# EasyEDA Pro project Source_Doom_Bcard.epro

# Schematic Schematic1
Board Name: Board1; Create Date: 2026-06-03; Page Name: P1; Project Name: DOOM Busniess Card; Schematic Name: Schematic1; Update Date: 2026-06-08; Company: EasyEDA.com; Page Size: A4; Version: V1.0
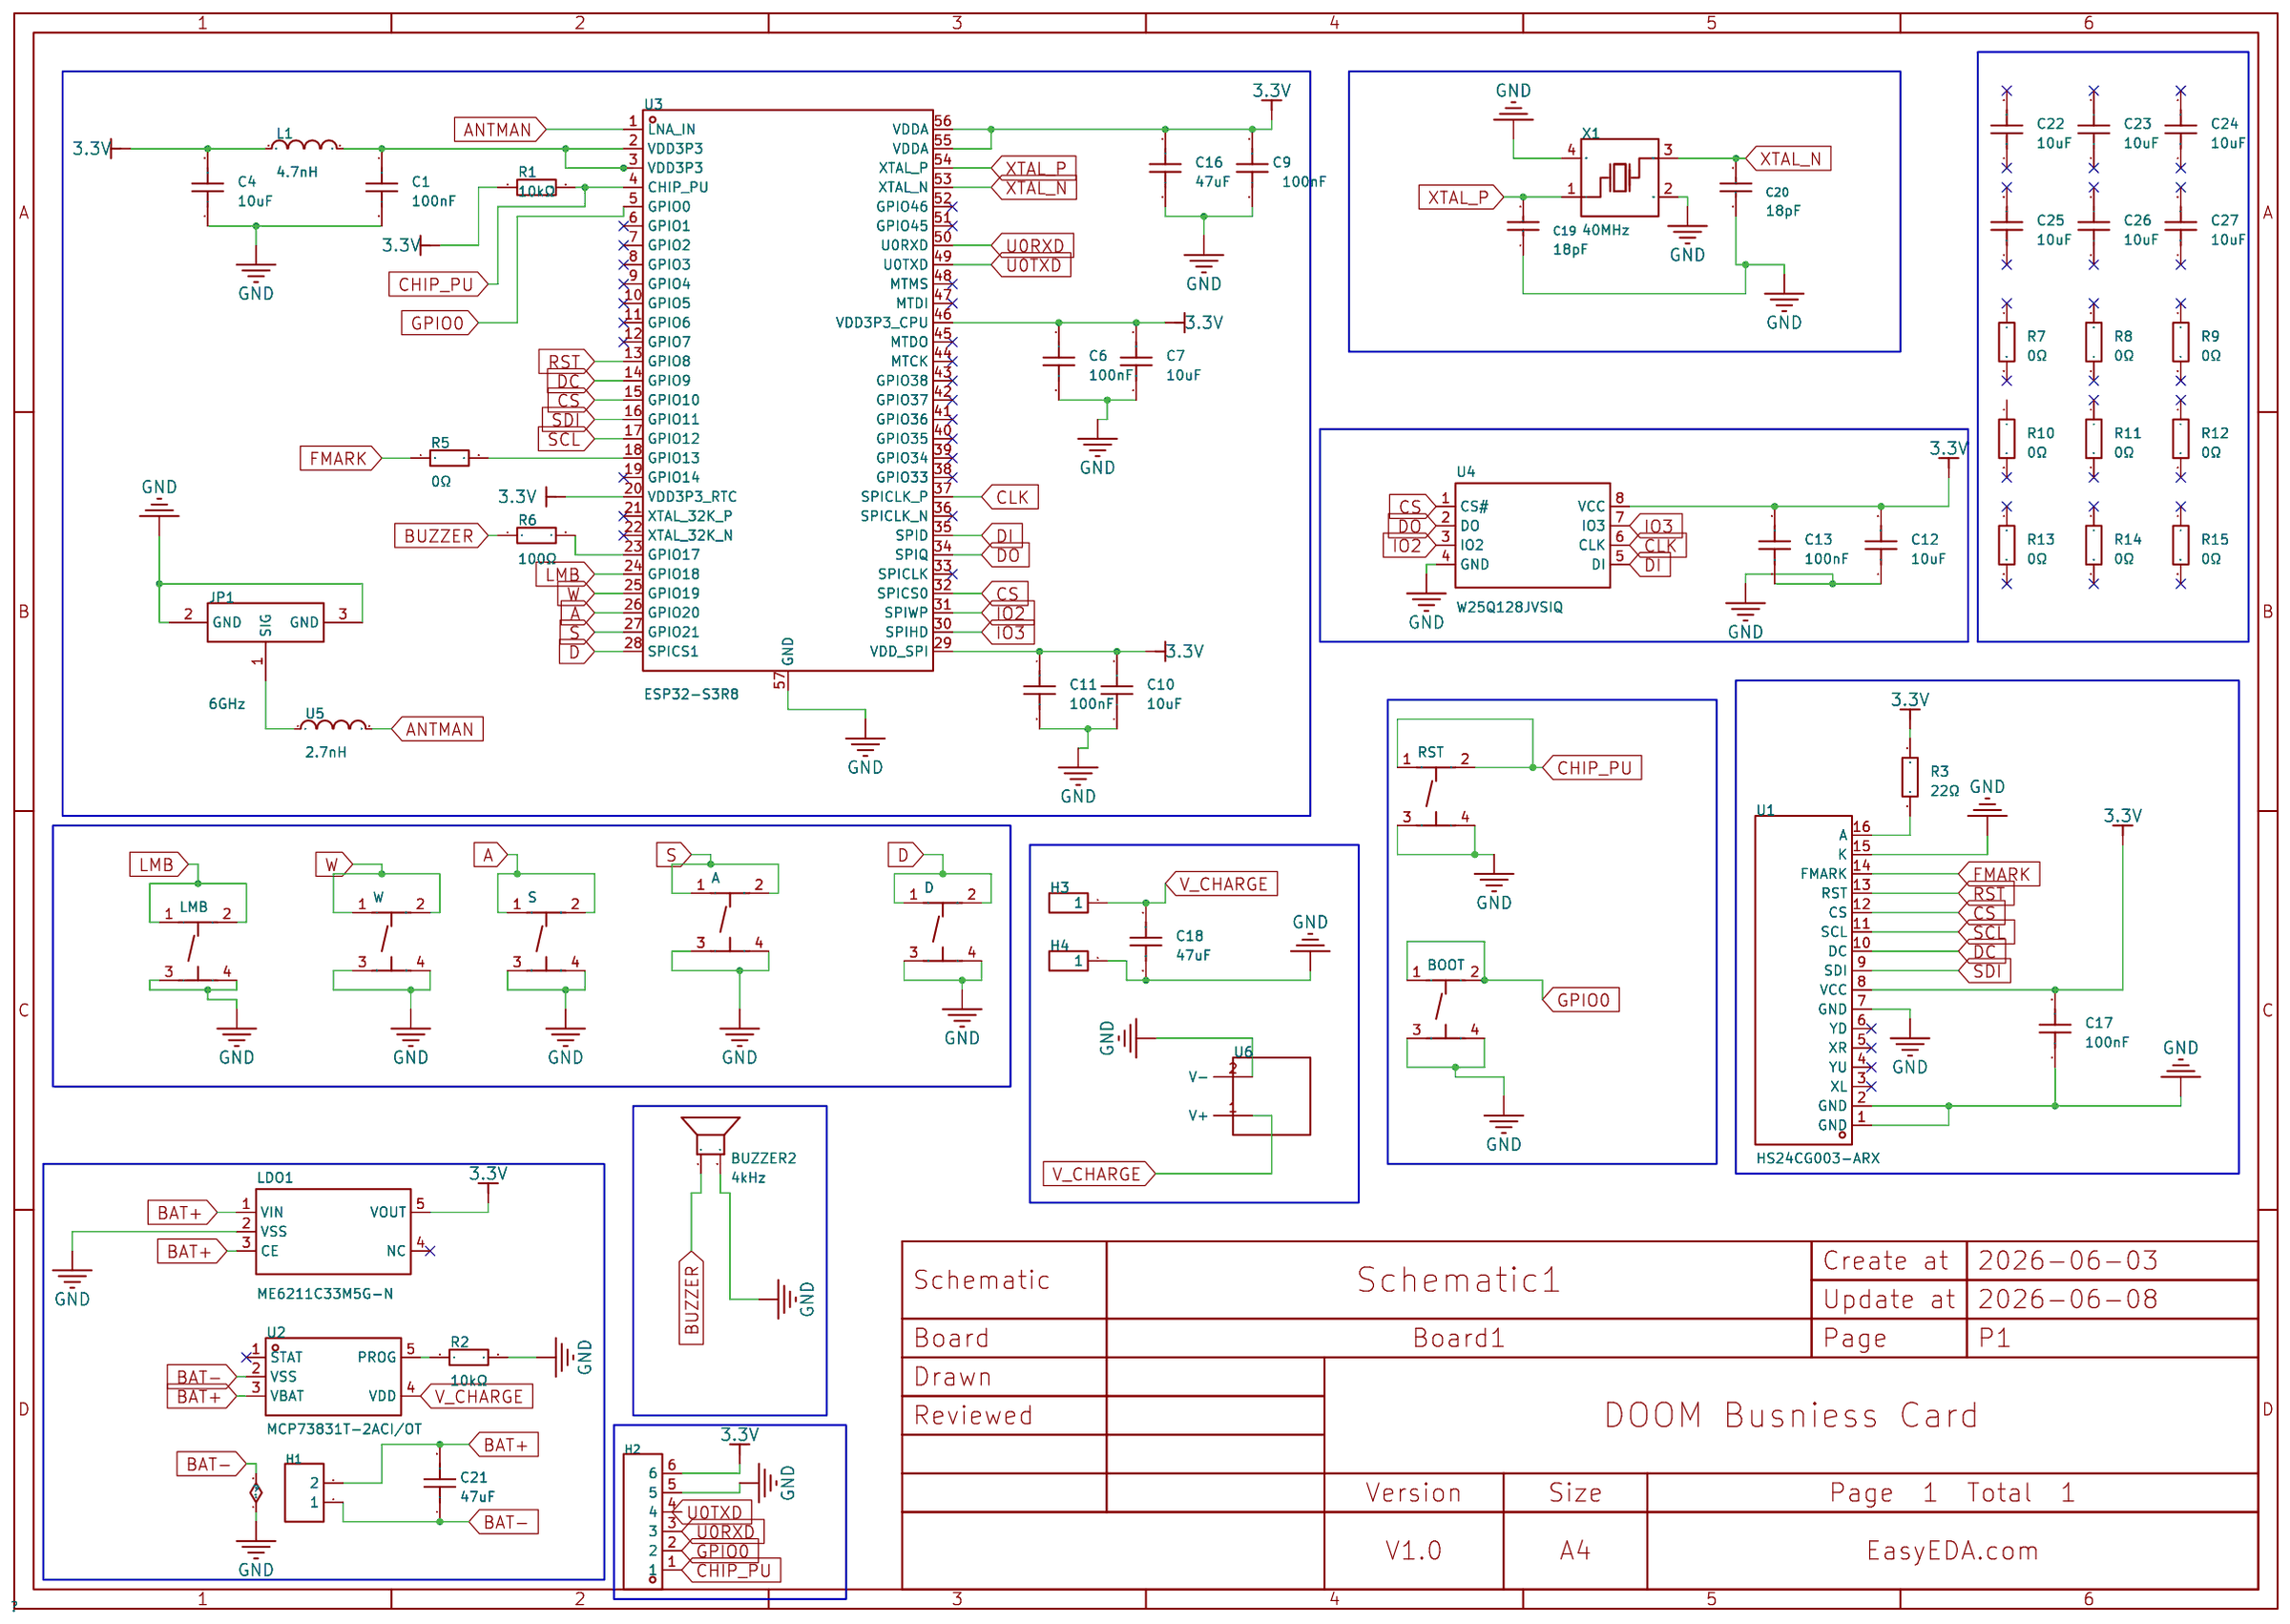
[diagram p0: schematic sheet]

## Parts
A  TS-1187A-B-A-B  [SW-SMD_4P-L5.1-W5.1-P3.70-LS6.5-TL_H1.5]
BOOT  TS-1187A-B-A-B  [SW-SMD_4P-L5.1-W5.1-P3.70-LS6.5-TL_H1.5]
BUZZER2  4kHz  [BUZ-SMD_L10.0-W10.0_GSC1030RB-3V4000]
C1  100nF  [C0402]
C4  10uF  [C0402]
C6  100nF  [C0402]
C7  10uF  [C0402]
C9  100nF  [C0402]
C10  10uF  [C0402]
C11  100nF  [C0402]
C12  10uF  [C0402]
C13  100nF  [C0402]
C16  47uF  [C0603]
C17  100nF  [C0402]
C18  47uF  [C0603]
C19  18pF  [C0402]
C20  18pF  [C0402]
C21  47uF  [C0603]
C22  10uF  [C0402]
C23  10uF  [C0402]
C24  10uF  [C0402]
C25  10uF  [C0402]
C26  10uF  [C0402]
C27  10uF  [C0402]
D  TS-1187A-B-A-B  [SW-SMD_4P-L5.1-W5.1-P3.70-LS6.5-TL_H1.5]
H1  -  [HDR-TH_2P-P2.54-V-F]
H2  -  [HDR-TH_6P-P2.54-V-F]
H3  -  [HDR-TH_1P-V-M_XKB_X4611WV-01I-C28D40]
H4  -  [HDR-TH_1P-V-M_XKB_X4611WV-01I-C28D40]
JP1  6GHz  [RF-SMD_FRF05002-JSS103M]
L1  4.7nH  [L0402-RD]
LDO1  ME6211C33M5G-N  [SOT-23-5_L3.0-W1.7-P0.95-LS2.8-BL]
LMB  TS-1187A-B-A-B  [SW-SMD_4P-L5.1-W5.1-P3.70-LS6.5-TL_H1.5]
R1  10kΩ  [R0402]
R2  10kΩ  [R0402]
R3  22Ω  [R0402]
R5  0Ω  [R0402]
R6  100Ω  [R0402]
R7  0Ω  [R0402]
R8  0Ω  [R0402]
R9  0Ω  [R0402]
R10  0Ω  [R0402]
R11  0Ω  [R0402]
R12  0Ω  [R0402]
R13  0Ω  [R0402]
R14  0Ω  [R0402]
R15  0Ω  [R0402]
RST  TS-1187A-B-A-B  [SW-SMD_4P-L5.1-W5.1-P3.70-LS6.5-TL_H1.5]
S  TS-1187A-B-A-B  [SW-SMD_4P-L5.1-W5.1-P3.70-LS6.5-TL_H1.5]
U1  HS24CG003-ARX  [LCD-SMD_HS24CG003-ARX]
U2  MCP73831T-2ACI/OT  [SOT-23-5_L3.0-W1.7-P0.95-LS2.8-BL]
U3  ESP32-S3R8  [QFN-56_L7.0-W7.0-P0.40-TL-EP4.0]
U4  W25Q128JVSIQ  [SOIC-8_L5.3-W5.3-P1.27-LS8.0-BL]
U5  2.7nH  [L0402]
U6  -  [Voltatic 0.3 Watt 6 Volt Solar panel]
W  TS-1187A-B-A-B  [SW-SMD_4P-L5.1-W5.1-P3.70-LS6.5-TL_H1.5]
X1  40MHz  [OSC-SMD_4P-L3.2-W2.5-BL_SIT8008BI]

## Library data of the parts
A BOOT D LMB RST S W = TS-1187A-B-A-B: Circuit:SPST Actuator Style:Round Button Operating Force:1.6N Mounting Type:Surface Mount,Vertical Length:5.1mm Width:5.1mm Switch Height:1.5mm with Bracket:Without Bracket Contact Current:50mA Voltage Rating:12V Actuator/Cap Color:Gold With Lamp:No Life:; LCSC Part Name: 5.1*5.1*1.5mm 立贴 轻触开关; Supplier Part: C318884; Manufacturer: XKB Connection(中国星坤); Supplier Footprint: SMD; JLCPCB Part Class: Basic Part; Datasheet: https://item.szlcsc.com/datasheet/TS-1187A-B-A-B/299976.html; Supplier: LCSC; Circuit: SPST; Actuator Style: Round Button; Operating Force: 1.6N; Mounting Type: Surface Mount,Vertical; Length: 5.1mm; Width: 5.1mm; Switch Height: 1.5mm; with Bracket: Without Bracket; Contact Current: 50mA; Voltage Rating: 12V; Actuator/Cap Color: Gold; With Lamp: No; Life: 100,000 Cycles; Operating Temperature: -30℃~+85℃
BUZZER2 = GSC1030RB-3V4000: Driver Circuitry:Passive (Externally Driven) Technology:Piezoelectric Voltage Rating:3V Voltage - Supply:1V~25V Voltage - Supply:1V~25V Frequency:4kHz Current Consumption:5mA Sound Pressure Level(SPL):72dB Length:10mm Width:10mm Height:3.3mm Operating Tem; LCSC Part Name: 压电无源蜂鸣器; Supplier Part: C255330; Manufacturer: INGHAi(赢海); JLCPCB Part Class: Extended Part; Datasheet: https://item.szlcsc.com/datasheet/GSC1030RB-3V4000/249282.html; Supplier: LCSC; Driver Circuitry: Passive (Externally Driven); Technology: Piezoelectric; Voltage Rating: 3V; Voltage - Supply: 1V~25V; Current Consumption: 5mA; Sound Pressure Level(SPL): 72dB; Length: 10mm; Width: 10mm; Height: 3.3mm; Operating Temperature: -20℃~+60℃
C1 C6 C9 C11 C13 C17 = CC0402KRX7R9BB104: Capacitance: Tolerance:±10% Tolerance:±10% Voltage Rated: Temperature Coefficient:; LCSC Part Name: 100nF ±10% 50V; Supplier Part: C131394; Manufacturer: YAGEO(国巨); Supplier Footprint: 0402; JLCPCB Part Class: Extended Part; Datasheet: https://atta.szlcsc.com/upload/public/pdf/source/20181008/C309510_22F155564471FAF6A489F7D68F34234E.pdf; Supplier: LCSC; Tolerance: ±10%
C4 C7 C10 C12 C22-C27 = CL05A106MP5NUNC_C315248: Capacitance:10uF Tolerance:±20% Tolerance:±20% Voltage Rating:10V Temperature Coefficient:X5R; LCSC Part Name: 10uF ±20% 10V; Supplier Part: C315248; Manufacturer: SAMSUNG(三星); Manufacturer Part: CL05A106MP5NUNC; Supplier Footprint: 0402; JLCPCB Part Class: Extended Part; Datasheet: https://item.szlcsc.com/datasheet/CL05A106MP5NUNC/297154.html; Supplier: LCSC; Tolerance: ±20%; Voltage Rating: 10V; Temperature Coefficient: X5R
C16 C18 C21 = CL10A476MQ8QRNC: LCSC Part Name: 47uF ±20% 6.3V; Supplier Part: C730416; Manufacturer: SAMSUNG(三星); Supplier Footprint: 0603; JLCPCB Part Class: Extended Part; Datasheet: https://atta.szlcsc.com/upload/public/pdf/source/20160218/1457707763339.pdf; Supplier: LCSC; Tolerance: ±20%
C19 C20 = CC0402JRNPO9BN180: Capacitance:18pF Tolerance:±5% Tolerance:±5% Voltage Rating:50V Temperature Coefficient:NP0; LCSC Part Name: 18pF ±5% 50V; Supplier Part: C106202; Manufacturer: YAGEO(国巨); Supplier Footprint: 0402; JLCPCB Part Class: Extended Part; Datasheet: https://item.szlcsc.com/datasheet/CC0402JRNPO9BN180/107417.html; Supplier: LCSC; Tolerance: ±5%; Voltage Rating: 50V; Temperature Coefficient: NP0
H1 = HDR-F_2.54_1x2P: Supplier Footprint: Through
H2 = HDR-F_2.54_1x6P: Supplier Footprint: Through
H3 H4 = HDR-M_2.54_1x1P: Supplier Footprint: Through; Check: false
JP1 = U.FL-R-SMT-1(80)_C88374: Connector Type:Board Side Interface:Male Pin Number of Ports:1 Interface Diameter:2mm Interface Length/Height:1.25mm Frequency:6GHz RF Series:IPEX Impedance:50Ω Style:- Operating Temperature Range:-40℃~+90℃ Operating Temperature Range:-40℃~+90℃; LCSC Part Name: IPEX 内针; Supplier Part: C88374; Manufacturer: HRS(广濑); Manufacturer Part: U.FL-R-SMT-1(80); Supplier Footprint: SMD; JLCPCB Part Class: Extended Part; Datasheet: https://item.szlcsc.com/datasheet/U.FL-R-SMT-1(80)/89553.html; Supplier: LCSC; Connector Type: Board Side; Interface: Male Pin; Number of Ports: 1; Interface Diameter: 2mm; Interface Length/Height: 1.25mm; RF Series: IPEX; Impedance: 50Ω; Operating Temperature Range: -40℃~+90℃
L1 = MLG1005S4N7CT000: Inductance: Tolerance:- Tolerance:- Current Rating: Current - Saturation (Isat):- DC Resistance(DCR): Q @ Frequency:8@100MHz Frequency - Self Resonant: Ratings:; LCSC Part Name: ±0.2nH 4.7nH; Supplier Part: C275292; Manufacturer: TDK; Supplier Footprint: 0402; JLCPCB Part Class: Extended Part; Datasheet: https://atta.szlcsc.com/upload/public/pdf/source/20240116/5498F69597B6145D9954BDAE22913204.pdf; Supplier: LCSC; Q @ Frequency: 8@100MHz
LDO1 = ME6211C33M5G-N: Output Type:Fixed Voltage - Supply:6V Output Voltage:3.3V Output Voltage:3.3V Output Current:500mA Power Supply Rejection Ratio (PSRR):70dB@(1kHz) Voltage Dropout:120mV@(100mA) standby current:60uA Noise:50uVrms Features:Over Current Protection；Enable；Sho; LCSC Part Name: 输入6V 输出3.3V 500mA; Supplier Part: C82942; Manufacturer: MICRONE(南京微盟); Supplier Footprint: SOT-23-5; JLCPCB Part Class: Extended Part; Datasheet: https://item.szlcsc.com/datasheet/ME6211C33M5G-N/84106.html; Supplier: LCSC; Output Type: Fixed; Voltage - Supply: 6V; Output Voltage: 3.3V; Output Current: 500mA; Power Supply Rejection Ratio (PSRR): 70dB@(1kHz); Voltage Dropout: 120mV@(100mA); standby current: 60uA; Noise: 50uVrms; Features: Over Current Protection；Enable；Short Circuit Protection; Operating Temperature: -40℃~+150℃; Output Configuration: Positive; Number of Outputs: 1
R1 R2 = RT0402BRD0710KL: Type:Thin Film Resistor Resistance:10kΩ Tolerance:±0.1% Tolerance:±0.1% Power(Watts):62.5mW Voltage-Supply(Max):50V Temperature Coefficient:±25ppm/℃ Temperature Coefficient:±25ppm/℃ Operating Temperature:-55℃~+155℃ Operating Temperature:-55℃~+155℃; LCSC Part Name: 薄膜电阻 10kΩ ±0.1% 62.5mW; Supplier Part: C190095; Manufacturer: YAGEO(国巨); Supplier Footprint: 0402; JLCPCB Part Class: Extended Part; Datasheet: https://item.szlcsc.com/datasheet/RT0402BRD0710KL/208478.html; Supplier: LCSC; Type: Thin Film Resistor; Tolerance: ±0.1%; Power(Watts): 62.5mW; Voltage-Supply(Max): 50V; Temperature Coefficient: ±25ppm/℃; Operating Temperature: -55℃~+155℃
R3 = RC0402FR-0722RL: Type:Thick Film Resistors Resistance: Tolerance:±1% Tolerance:±1% Power(Watts): Overload Voltage (Max): Temperature Coefficient:±100ppm/℃ Temperature Coefficient:±100ppm/℃ Operating Temperature Range:-55℃~+155℃ Operating Temperature Range:-55℃~+155℃; LCSC Part Name: 厚膜电阻 22Ω ±1% 62.5mW; Supplier Part: C114765; Manufacturer: YAGEO(国巨); Supplier Footprint: 0402; JLCPCB Part Class: Extended Part; Datasheet: https://atta.szlcsc.com/upload/public/pdf/source/20180821/C275644_0D56F95EFF785E7D9A1FEF436B37DA78.pdf; Supplier: LCSC; Type: Thick Film Resistors; Tolerance: ±1%; Temperature Coefficient: ±100ppm/℃; Operating Temperature Range: -55℃~+155℃
R5 R7-R15 = RC0402FR-070RL: Type:Thick Film Resistors Resistance:0Ω Tolerance:±1% Tolerance:±1% Power(Watts):62.5mW Voltage-Supply(Max):50V Temperature Coefficient:- Temperature Coefficient:- Operating Temperature:-55℃~+155℃ Operating Temperature:-55℃~+155℃; LCSC Part Name: 厚膜电阻 0Ω ±1% 62.5mW; Supplier Part: C106231; Manufacturer: YAGEO(国巨); Supplier Footprint: 0402; JLCPCB Part Class: Extended Part; Datasheet: https://item.szlcsc.com/datasheet/RC0402FR-070RL/107446.html; Supplier: LCSC; Type: Thick Film Resistors; Tolerance: ±1%; Power(Watts): 62.5mW; Voltage-Supply(Max): 50V; Operating Temperature: -55℃~+155℃
R6 = RC0402FR-07100RL: Type:Thick Film Resistor Resistance:100Ω Tolerance:±1% Tolerance:±1% Power(Watts):62.5mW Voltage-Supply(Max):50V Temperature Coefficient:±100ppm/℃ Temperature Coefficient:±100ppm/℃ Operating Temperature:-55℃~+155℃ Operating Temperature:-55℃~+155℃; LCSC Part Name: 厚膜电阻 100Ω ±1% 62.5mW; Supplier Part: C106232; Manufacturer: YAGEO(国巨); Supplier Footprint: 0402; JLCPCB Part Class: Extended Part; Datasheet: https://item.szlcsc.com/datasheet/RC0402FR-07100RL/107447.html; Supplier: LCSC; Type: Thick Film Resistor; Tolerance: ±1%; Power(Watts): 62.5mW; Voltage-Supply(Max): 50V; Temperature Coefficient: ±100ppm/℃; Operating Temperature: -55℃~+155℃
U1 = HS24CG003-ARX: Controller Type:ST7789 Interface:SPI Size:2.4 Dot Pixels:320x240 Operating Temperature:-20℃~+70℃ Operating Temperature:-20℃~+70℃ Display Range:36.72x48.96mm Voltage - Supply:2.4V~3.3V；1.65V~3.3V Voltage - Supply:2.4V~3.3V；1.65V~3.3V; LCSC Part Name: 2.4寸240*320(RGB)彩色SPI串口TFT液晶显示屏; Supplier Part: C5329583; Manufacturer: HS(汉昇); JLCPCB Part Class: Extended Part; Datasheet: https://item.szlcsc.com/datasheet/HS24CG003-ARX/6087844.html; Supplier: LCSC; Controller Type: ST7789; Interface: SPI; Size: 2.4; Dot Pixels: 320x240; Operating Temperature: -20℃~+70℃; Display Range: 36.72x48.96mm; Voltage - Supply: 2.4V~3.3V；1.65V~3.3V
U2 = MCP73831T-2ACI/OT: The Chip Type:Charging IC Voltage - Supply:3.75V~6V Voltage - Supply:3.75V~6V Charge Current - Max:550mA Charging Saturation Voltage:4.2V End-Off Voltage:- Type of Battery:Lithium Battery Number of Cells:1 Number of Cells:1 Operating Temperature:-40℃~+85℃; LCSC Part Name: 单节锂离子/锂聚合物充电管理控制器; Supplier Part: C424093; Manufacturer: MICROCHIP(美国微芯); Supplier Footprint: SOT-23-5; JLCPCB Part Class: Extended Part; Datasheet: https://item.szlcsc.com/datasheet/MCP73831T-2ACI%252FOT/417116.html; Supplier: LCSC; The Chip Type: Charging IC; Voltage - Supply: 3.75V~6V; Charge Current - Max: 550mA; Charging Saturation Voltage: 4.2V; Type of Battery: Lithium Battery; Number of Cells: 1; Operating Temperature: -40℃~+85℃; Battery Temperature Detection: Not supported; Supply Current (Iq): 53uA
U3 = ESP32-S3R8: Frequency Range:2.412GHz~2.484GHz Frequency Range:2.412GHz~2.484GHz Interface:I2C；I2S；UART；USB；SPI Voltage - Supply:3V~3.6V Voltage - Supply:3V~3.6V Applications:Bluetooth；WiFi Output Power:18.5dBm Data Rate:150Mbps Current Of Transmitting:283mA Sensitivi; LCSC Part Name: 不带固件 2.4GHz Wi-Fi + 低功耗蓝牙系统级芯片（SoC）; Supplier Part: C2913194; Manufacturer: ESPRESSIF(乐鑫); Supplier Footprint: QFN-56(7x7); JLCPCB Part Class: Extended Part; Datasheet: https://item.szlcsc.com/datasheet/ESP32-S3R8/3198292.html; Supplier: LCSC; Frequency Range: 2.412GHz~2.484GHz; Interface: I2C；I2S；UART；USB；SPI; Voltage - Supply: 3V~3.6V; Applications: Bluetooth；WiFi; Output Power: 18.5dBm; Data Rate: 150Mbps; Current Of Transmitting: 283mA; Sensitivity: -74.2dBm; Receive Current: 88mA; Typical Application Frequency: 2.4GHz; Operating Temperature: -40℃~+65℃; Type: transceiver
U4 = W25Q128JVSIQ: Interface:SPI Memory Size:128Mbit Clock Frequency:133MHz Voltage - Supply:2.7V~3.6V Voltage - Supply:2.7V~3.6V Standby Supply Current:1uA Program / Erase Cycles:100,000 Cycles Page Programming Time (Tpp):3ms Block Erase Time(tBE):120ms@(32KB) Data Retenti; LCSC Part Name: 编带 支持双路/四路SPI接口的3V、128Mbit 串行闪存; Supplier Part: C97521; Manufacturer: Winbond(华邦); Supplier Footprint: SOIC-8-208mil; JLCPCB Part Class: Basic Part; Datasheet: https://item.szlcsc.com/datasheet/W25Q128JVSIQ/98729.html; Supplier: LCSC; Interface: SPI; Memory Size: 128Mbit; Clock Frequency: 133MHz; Voltage - Supply: 2.7V~3.6V; Standby Supply Current: 1uA; Program / Erase Cycles: 100,000 Cycles; Page Programming Time (Tpp): 3ms; Block Erase Time(tBE): 120ms@(32KB); Data Retention - TDR (Year): 20 Years; Operating Temperature: -40℃~+85℃
U5 = LQW15AN2N7B8ZD: Inductance:2.7nH Current Rating:1.5A DC Resistance(DCR):47mΩ Ratings:AEC-Q200; Supplier Part: C7295850; Manufacturer: muRata(村田); Supplier Footprint: 0402; JLCPCB Part Class: Extended Part; Datasheet: https://item.szlcsc.com/datasheet/LQW15AN2N7B8ZD/8265729.html; Supplier: LCSC; Current Rating: 1.5A; DC Resistance(DCR): 47mΩ; Ratings: AEC-Q200
U6 = Voltatic 0.3 Watt 6 Volt Panel: Solar Panel; Check: false
X1 = X322540MPB4SI: Type:Crystal Oscillator Frequency:40MHz Normal temperature Frequency Tolerance:±10ppm Normal temperature Frequency Tolerance:±10ppm Load Capacitance:15pF Frequency Stability:±20ppm Frequency Stability:±20ppm Operating Temperature:-40℃~+85℃ Operating Tempe; LCSC Part Name: YSX321SL 40MHZ 4P 3225 15PF ±10PPM -40~85℃ (±20PPM); Supplier Part: C9010; Manufacturer: YXC(扬兴晶振); Supplier Footprint: SMD3225-4P; JLCPCB Part Class: Extended Part; Datasheet: https://item.szlcsc.com/datasheet/X322540MPB4SI/9530.html; Supplier: LCSC; Type: Crystal Oscillator; Normal temperature Frequency Tolerance: ±10ppm; Load Capacitance: 15pF; Frequency Stability: ±20ppm; Operating Temperature: -40℃~+85℃

## Nets
3.3V: C4.2 C6.1 C7.2 C9.1 C10.2 C11.1 C12.2 C13.1 C16.1 C17.2 H2.6 L1.1 LDO1.5(VOUT) R1.1 R3.1 U1.8(VCC) U3.20(VDD3P3_RTC) U3.29(VDD_SPI) U3.46(VDD3P3_CPU) U3.55(VDDA) U3.56(VDDA) U4.8(VCC)
GND: A.3(C) A.4(D) BOOT.3(C) BOOT.4(D) BUZZER2.2 C1.2 C4.1 C6.2 C7.1 C9.2 C10.1 C11.2 C12.1 C13.2 C16.2 C17.1 C18.2 C19.1 C20.1 C21.1 D.3(C) D.4(D) H1.1 H2.5 H4.1 JP1.2(GND) JP1.3(GND) LDO1.2(VSS) LMB.3(C) LMB.4(D) R2.2 RST.3(C) RST.4(D) S.3(C) S.4(D) U1.1(GND) U1.2(GND) U1.7(GND) U1.15(K) U2.2(VSS) U3.57(GND) U4.4(GND) U6.2(V-) W.3(C) W.4(D) X1.2(GND) X1.4(GND)
A: S.1(A) S.2(B) U3.26(GPIO20)
ANTMAN: U3.1(LNA_IN) U5.2
BAT+: C21.2 H1.2 LDO1.1(VIN) LDO1.3(CE) U2.3(VBAT)
BUZZER: BUZZER2.1 R6.1
CHIP_PU: H2.1 R1.2 RST.1(A) RST.2(B) U3.4(CHIP_PU)
CLK: U3.37(SPICLK_P) U4.6(CLK)
CS: U1.12(CS) U3.15(GPIO10) U3.32(SPICS0) U4.1(CS#)
D: D.1(A) D.2(B) U3.28(SPICS1)
DC: U1.10(DC) U3.14(GPIO9)
DI: U3.35(SPID) U4.5(DI)
DO: U3.34(SPIQ) U4.2(DO)
FMARK: R5.1 U1.14(FMARK)
GPIO0: BOOT.1(A) BOOT.2(B) H2.2 U3.5(GPIO0)
IO2: U3.31(SPIWP) U4.3(IO2)
IO3: U3.30(SPIHD) U4.7(IO3)
LMB: LMB.1(A) LMB.2(B) U3.24(GPIO18)
RST: U1.13(RST) U3.13(GPIO8)
S: A.1(A) A.2(B) U3.27(GPIO21)
SCL: U1.11(SCL) U3.17(GPIO12)
SDI: U1.9(SDI) U3.16(GPIO11)
U0RXD: H2.3 U3.50(U0RXD)
U0TXD: H2.4 U3.49(U0TXD)
V_CHARGE: C18.1 H3.1 U2.4(VDD) U6.1(V+)
W: U3.25(GPIO19) W.1(A) W.2(B)
XTAL_N: C20.2 U3.53(XTAL_N) X1.3(OSC2)
XTAL_P: C19.2 U3.54(XTAL_P) X1.1(OSC1)
$1N2639: C1.1 L1.2 U3.2(VDD3P3) U3.3(VDD3P3)
$1N3558: R2.1 U2.5(PROG)
$1N4066: R3.2 U1.16(A)
$1N4566: R5.2 U3.18(GPIO13)
$1N5214: JP1.1(SIG) U5.1
$1N5309: R6.2 U3.23(GPIO17)

Not connected (* = marked no-connect by the designer): C22 1* 2*; C23 1* 2*; C24 1* 2*; C25 1* 2*; C26 1* 2*; C27 1* 2*; LDO1 4(NC)*; R7 1* 2*; R8 1* 2*; R9 1* 2*; R10 1 2*; R11 1* 2*; R12 1* 2*; R13 1* 2*; R14 1* 2*; R15 1* 2*; U1 3(XL)* 4(YU)* 5(XR)* 6(YD)*; U2 1(STAT)*; U3 6(GPIO1)* 7(GPIO2)* 8(GPIO3)* 9(GPIO4)* 10(GPIO5)* 11(GPIO6)* 12(GPIO7)* 19(GPIO14)* 21(XTAL_32K_P)* 22(XTAL_32K_N)* 33(SPICLK)* 36(SPICLK_N)* 38(GPIO33)* 39(GPIO34)* 40(GPIO35)* 41(GPIO36)* 42(GPIO37)* 43(GPIO38)* 44(MTCK)* 45(MTDO)* 47(MTDI)* 48(MTMS)* 51(GPIO45)* 52(GPIO46)*

# Board PCB1
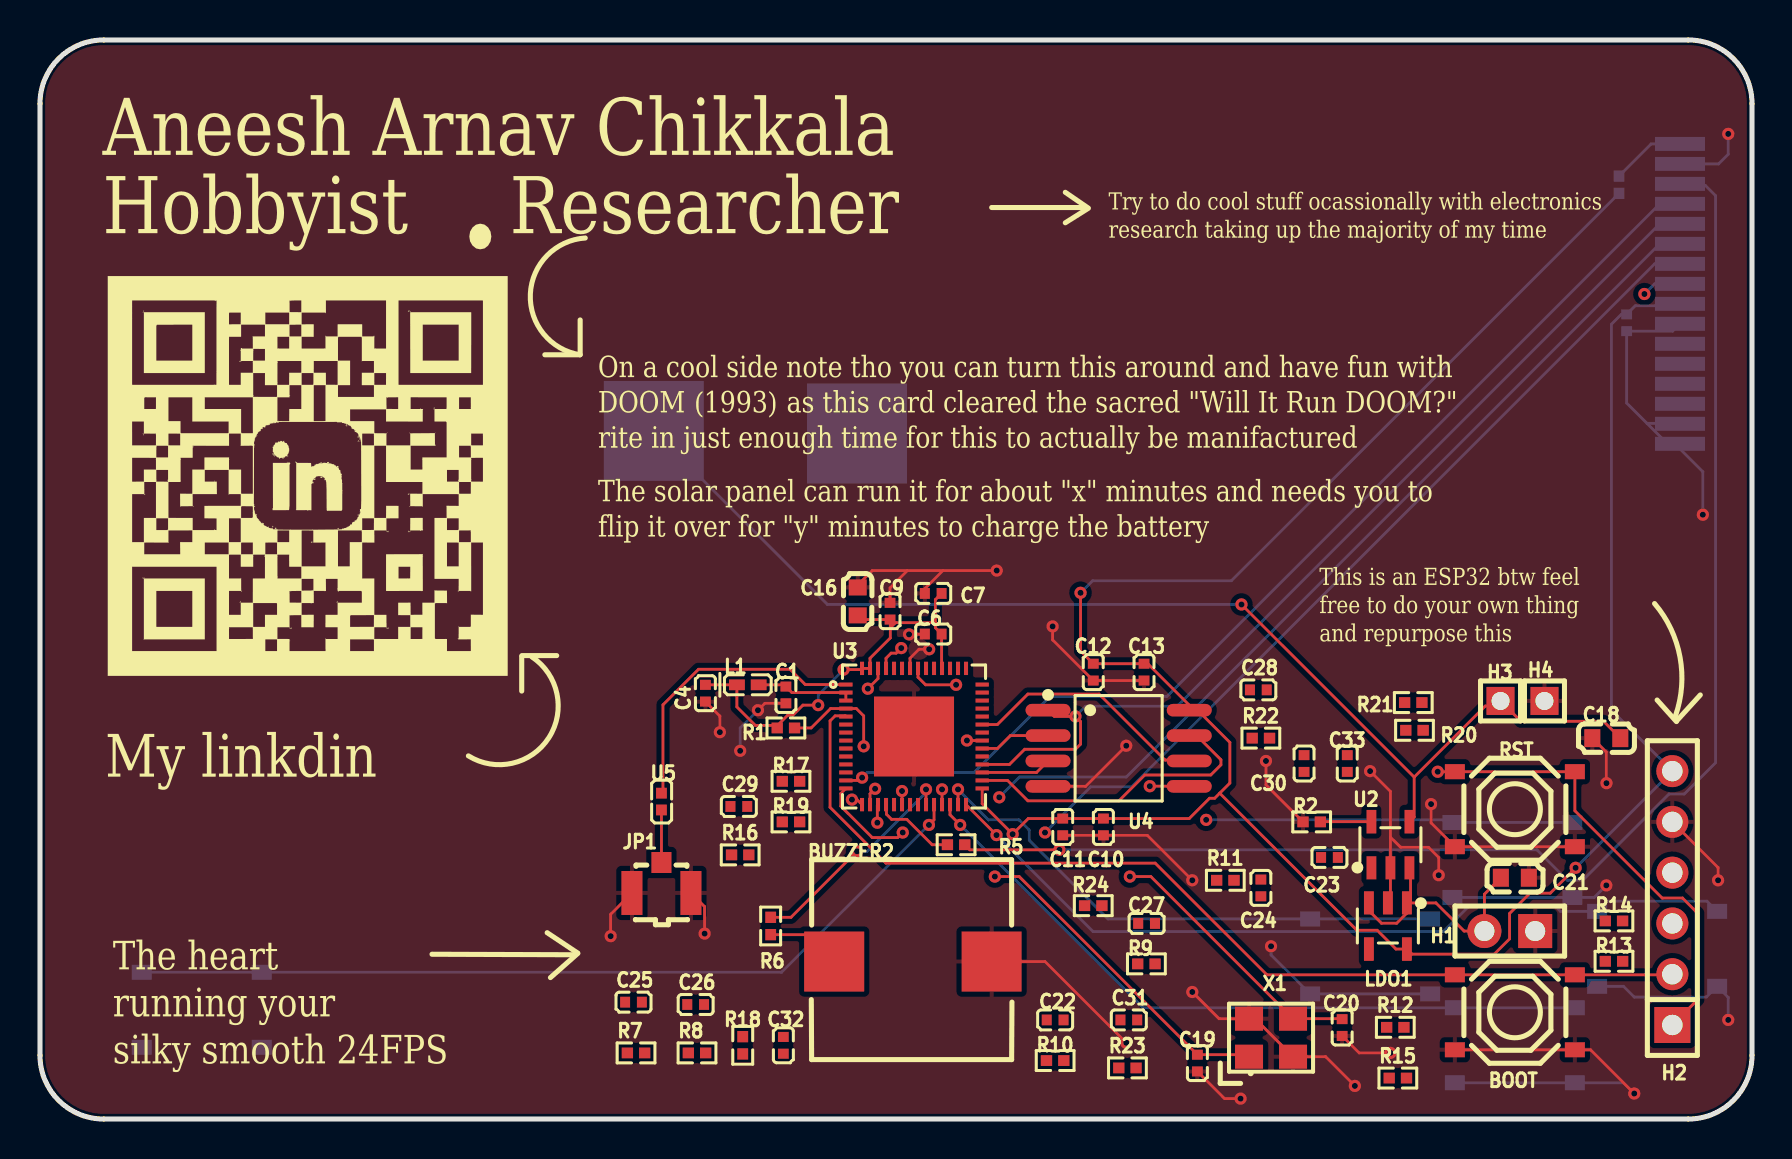
[diagram p1: board, top side]
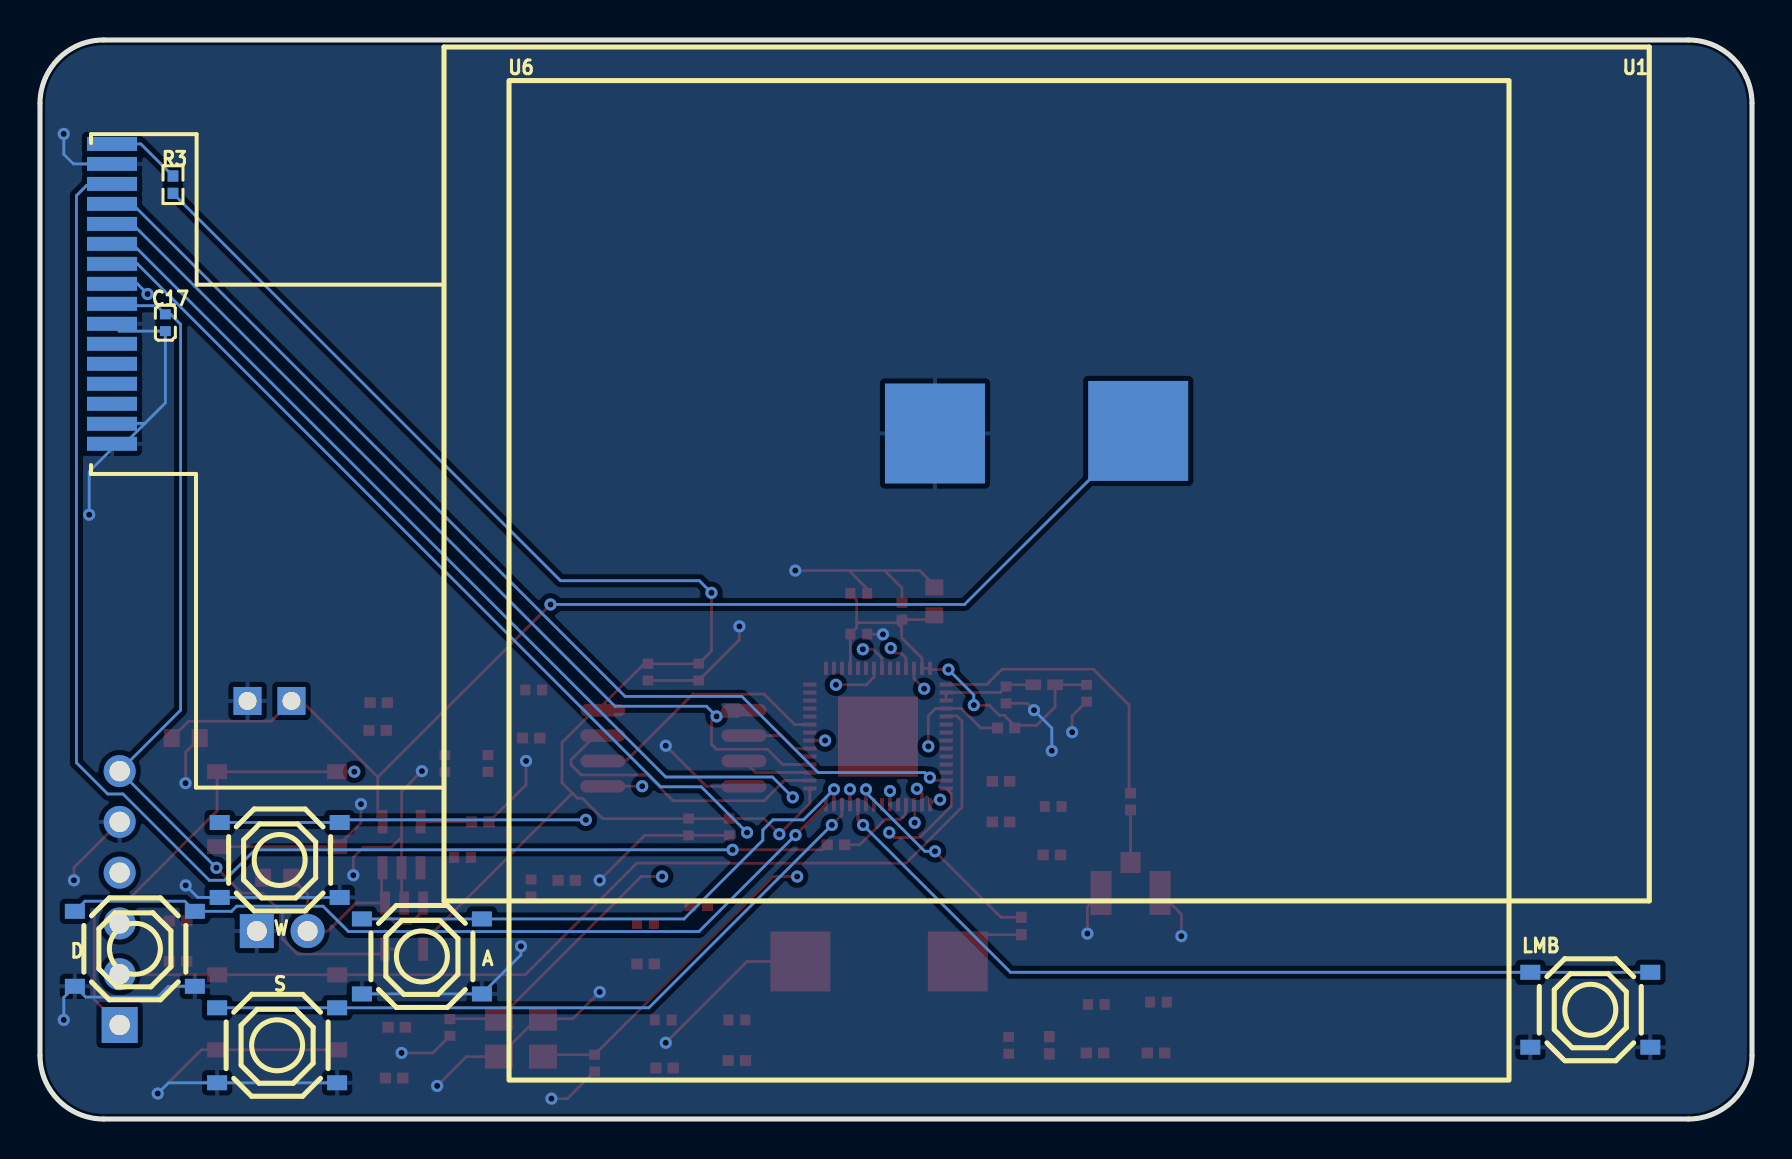
[diagram p2: board, bottom side, seen from below]

Outline 85.6 x 53.98 mm; copper layers: Top Layer, Inner1, Inner2, Bottom Layer. Coordinates in mm from the lower left corner of the outline.
Outline path: 0,50.8 0,3.18 arc(0.93,0.93) 3.18,0 82.42,0 arc(84.67,0.93) 85.6,3.18 85.6,50.8 arc(84.67,53.05) 82.42,53.98 3.18,53.98 arc(0.93,53.05) 0,50.8
Stack: Top Layer 0.035mm Outer layer thickness 1oz / Dielectric1 0.2104mm 7628 RC49% 8.6mil / Inner1 0.0152mm Inner layer thickness / Dielectric2 1.065mm 1.1mm H/HOZ Copper / Inner2 0.0152mm Inner layer thickness / Dielectric3 0.2104mm 7628 RC49% 8.6mil / Bottom Layer 0.035mm Outer layer thickness 1oz

## Design rules (mm)
spacing copperThickness1oz (default): track to track 0.102, other pairs 0.152 to 0.3
spacing copperThickness2oz: track to track 0.203, other pairs 0.152 to 0.3
spacing copperThicknessInner0.5oz: track to track 0.089, other pairs 0.152 to 0.3
spacing Plane_innerPlane: track to track 0.102, other pairs 0.152 to 0.3
spacing Copper_copperRegion: track to track 0.102, other pairs 0.152 to 0.3
track width copperThickness1oz (default): min 0.102, default 0.254, max 2.54
track width copperThickness2oz: min 0.203, default 0.254, max 2.54
track width copperThickness0.5oz: min 0.089, default 0.254, max 2.54
differential pair differentialPair (default): width min 0.127, default 0.254, max 2.54; gap min 0.152, default 0.152
pour e516 uses Copper_copperRegion
pour e575 uses Copper_copperRegion
pour e589 uses Copper_copperRegion
pour e604 uses Copper_copperRegion

## Placement (name value [footprint] x y rotation side)
A  TS-1187A-B-A-B  [SW-SMD_4P-L5.1-W5.1-P3.70-LS6.5-TL_H1.5]  66.51 8.13 180 bottom
BOOT  TS-1187A-B-A-B  [SW-SMD_4P-L5.1-W5.1-P3.70-LS6.5-TL_H1.5]  73.74 5.34 0 top
BUZZER2  4kHz  [BUZ-SMD_L10.0-W10.0_GSC1030RB-3V4000]  43.64 7.88 270 top
C1  100nF  [C0402]  37.3 21.21 270 top
C4  10uF  [C0402]  33.27 21.3 90 top
C6  100nF  [C0402]  44.66 24.26 180 top
C7  10uF  [C0402]  44.66 26.29 0 top
C9  100nF  [C0402]  42.5 25.41 90 top
C10  10uF  [C0402]  53.17 14.61 90 top
C11  100nF  [C0402]  51.14 14.61 270 top
C12  10uF  [C0402]  52.66 22.36 90 top
C13  100nF  [C0402]  55.2 22.36 270 top
C16  47uF  [C0603]  40.89 25.89 90 top
C17  100nF  [C0402]  79.33 39.83 90 bottom
C18  47uF  [C0603]  78.32 19.05 180 top
C19  18pF  [C0402]  57.87 2.8 90 top
C20  18pF  [C0402]  65.11 4.58 90 top
C21  47uF  [C0603]  73.74 12.07 180 top
C22  10uF  [C0402]  50.76 4.96 0 top
C23  10uF  [C0402]  64.47 13.09 0 top
C24  10uF  [C0402]  61.04 11.56 90 top
C25  10uF  [C0402]  29.67 5.85 0 top
C26  10uF  [C0402]  32.78 5.73 0 top
C27  10uF  [C0402]  55.33 9.78 0 top
C28  10uF  [C0402]  60.92 21.47 0 top
C29  10uF  [C0402]  34.94 15.64 0 top
C30  10uF  [C0402]  63.2 17.78 90 top
C31  10uF  [C0402]  54.44 4.96 0 top
C32  10uF  [C0402]  37.17 3.69 90 top
C33  10uF  [C0402]  65.36 17.78 90 top
D  TS-1187A-B-A-B  [SW-SMD_4P-L5.1-W5.1-P3.70-LS6.5-TL_H1.5]  80.86 8.51 180 bottom
H1  -  [HDR-TH_2P-P2.54-V-F]  73.49 9.4 180 top
H2  -  [HDR-TH_6P-P2.54-V-F]  81.62 11.05 90 top
H3  -  [HDR-TH_1P-V-M_XKB_X4611WV-01I-C28D40]  73.03 20.91 0 top
H4  -  [HDR-TH_1P-V-M_XKB_X4611WV-01I-C28D40]  75.22 20.91 0 top
JP1  6GHz  [RF-SMD_FRF05002-JSS103M]  31.07 12.07 180 top
L1  4.7nH  [L0402-RD]  35.39 21.72 0 top
LDO1  ME6211C33M5G-N  [SOT-23-5_L3.0-W1.7-P0.95-LS2.8-BL]  67.39 9.66 180 top
LMB  TS-1187A-B-A-B  [SW-SMD_4P-L5.1-W5.1-P3.70-LS6.5-TL_H1.5]  8.08 5.47 180 bottom
R1  10kΩ  [R0402]  37.3 19.56 0 top
R2  10kΩ  [R0402]  63.58 14.86 180 top
R3  22Ω  [R0402]  78.95 46.74 90 bottom
R5  0Ω  [R0402]  45.8 13.72 180 top
R6  100Ω  [R0402]  36.53 9.66 90 top
R7  0Ω  [R0402]  29.8 3.31 0 top
R8  0Ω  [R0402]  32.85 3.31 0 top
R9  0Ω  [R0402]  55.32 7.76 0 top
R10  0Ω  [R0402]  50.76 2.93 0 top
R11  0Ω  [R0402]  59.27 11.94 0 top
R12  0Ω  [R0402]  67.77 4.59 0 top
R13  0Ω  [R0402]  78.7 7.89 0 top
R14  0Ω  [R0402]  78.7 9.91 0 top
R15  0Ω  [R0402]  67.89 2.05 0 top
R16  0Ω  [R0402]  35.01 13.21 0 top
R17  0Ω  [R0402]  37.55 16.9 0 top
R18  0Ω  [R0402]  35.14 3.69 270 top
R19  0Ω  [R0402]  37.55 14.86 0 top
R20  0Ω  [R0402]  68.72 19.45 0 top
R21  0Ω  [R0402]  68.66 20.83 0 top
R22  0Ω  [R0402]  61.04 19.05 0 top
R23  0Ω  [R0402]  54.37 2.56 0 top
R24  0Ω  [R0402]  52.66 10.67 0 top
RST  TS-1187A-B-A-B  [SW-SMD_4P-L5.1-W5.1-P3.70-LS6.5-TL_H1.5]  73.74 15.5 0 top
S  TS-1187A-B-A-B  [SW-SMD_4P-L5.1-W5.1-P3.70-LS6.5-TL_H1.5]  73.74 3.69 180 bottom
U1  HS24CG003-ARX  [LCD-SMD_HS24CG003-ARX]  82 41.28 270 bottom
U2  MCP73831T-2ACI/OT  [SOT-23-5_L3.0-W1.7-P0.95-LS2.8-BL]  67.52 13.72 0 top
U3  ESP32-S3R8  [QFN-56_L7.0-W7.0-P0.40-TL-EP4.0]  43.7 19.14 0 top
U4  W25Q128JVSIQ  [SOIC-8_L5.3-W5.3-P1.27-LS8.0-BL]  53.93 18.55 270 top
U5  2.7nH  [L0402]  31.07 15.88 90 top
U6  -  [Voltatic 0.3 Watt 6 Volt Solar panel]  37.8 26.29 180 bottom
W  TS-1187A-B-A-B  [SW-SMD_4P-L5.1-W5.1-P3.70-LS6.5-TL_H1.5]  73.62 12.96 180 bottom
X1  40MHz  [OSC-SMD_4P-L3.2-W2.5-BL_SIT8008BI]  61.55 4.07 0 top

## Footprints (pads in the part's own frame, mm; a bottom-side part is the same pattern mirrored in y, then rotated)
BUZ-SMD_L10.0-W10.0_GSC1030RB-3V4000
  rect 3x3 smd: 1(0,-3.936) 2(0,3.936)
C0402
  rect 0.5x0.54 smd: 1(-0.42,0) 2(0.42,0)
C0603
  rect 0.8x0.9 smd: 1(-0.7,0) 2(0.7,0)
HDR-TH_1P-V-M_XKB_X4611WV-01I-C28D40
  rect 1.4x1.4 hole 0.9: 1(0,0)
HDR-TH_2P-P2.54-V-F
  rect 1.7x1.7 hole 1: 1(-1.27,0)
  round 1.7 hole 1: 2(1.27,0)
HDR-TH_6P-P2.54-V-F
  rect 1.8x1.8 hole 1.02: 1(-6.35,0)
  round 1.6 hole 1.02: 2(-3.81,0) 3(-1.27,0) 4(1.27,0) 5(3.81,0) 6(6.35,0)
L0402
  rect 0.54x0.54 smd: 1(-0.42,0) 2(0.42,0)
L0402-RD
  rect 0.79x0.54 smd: 1(-0.545,0) 2(0.545,0)
LCD-SMD_HS24CG003-ARX
  rect 0.7x2.5 smd: 1(7.5,0) 2(6.5,0) 3(5.5,0) 4(4.5,0) 5(3.5,0) 6(2.5,0) 7(1.5,0) 8(0.5,0) 9(-0.5,0) 10(-1.5,0) 11(-2.5,0) 12(-3.5,0) 13(-4.5,0) 14(-5.5,0) 15(-6.5,0) 16(-7.5,0)
OSC-SMD_4P-L3.2-W2.5-BL_SIT8008BI
  rect 1.4x1.2 smd: 1(-1.1,-0.95) 2(1.1,-0.95) 3(1.1,0.95) 4(-1.1,0.95)
QFN-56_L7.0-W7.0-P0.40-TL-EP4.0
  rect 0.665x0.2 smd: 1(-3.408,2.6) 2(-3.408,2.2) 3(-3.408,1.8) 4(-3.408,1.4) 5(-3.408,1) 6(-3.408,0.6) 7(-3.408,0.2) 8(-3.408,-0.2) 9(-3.408,-0.6) 10(-3.408,-1) 11(-3.408,-1.4) 12(-3.408,-1.8) 13(-3.408,-2.2) 14(-3.408,-2.6) 29(3.408,-2.6) 30(3.408,-2.2) 31(3.408,-1.8) 32(3.408,-1.4) 33(3.408,-1) 34(3.408,-0.6) 35(3.408,-0.2) 36(3.408,0.2) 37(3.408,0.6) 38(3.408,1) 39(3.408,1.4) 40(3.408,1.8) 41(3.408,2.2) 42(3.408,2.6)
  rect 0.2x0.665 smd: 15(-2.6,-3.408) 16(-2.2,-3.408) 17(-1.8,-3.408) 18(-1.4,-3.408) 19(-1,-3.408) 20(-0.6,-3.408) 21(-0.2,-3.408) 22(0.2,-3.408) 23(0.6,-3.408) 24(1,-3.408) 25(1.4,-3.408) 26(1.8,-3.408) 27(2.2,-3.408) 28(2.6,-3.408) 43(2.6,3.408) 44(2.2,3.408) 45(1.8,3.408) 46(1.4,3.408) 47(1,3.408) 48(0.6,3.408) 49(0.2,3.408) 50(-0.2,3.408) 51(-0.6,3.408) 52(-1,3.408) 53(-1.4,3.408) 54(-1.8,3.408) 55(-2.2,3.408) 56(-2.6,3.408)
  rect 4x4 smd: 57(0,0)
R0402
  rect 0.566x0.54 smd: 1(-0.433,0) 2(0.433,0)
RF-SMD_FRF05002-JSS103M
  rect 1x1.05 smd: 1(0,-0.762)
  rect 1.05x2.2 smd: 2(-1.475,0.762) 3(1.475,0.762)
SOIC-8_L5.3-W5.3-P1.27-LS8.0-BL
  oval 0.63x2.25 smd: 1(-1.905,-3.53) 2(-0.635,-3.53) 3(0.635,-3.53) 4(1.905,-3.53) 5(1.905,3.53) 6(0.635,3.53) 7(-0.635,3.53) 8(-1.905,3.53)
SOT-23-5_L3.0-W1.7-P0.95-LS2.8-BL
  rect 0.49x1.157 smd: 1(-0.95,-1.153) 2(0,-1.153) 3(0.95,-1.153)
  rect 0.49x1.175 smd: 4(0.95,1.153) 5(-0.95,1.153)
SW-SMD_4P-L5.1-W5.1-P3.70-LS6.5-TL_H1.5
  rect 1x0.75 smd: 1(-3,1.875) 2(3,1.875) 3(-3,-1.875) 4(3,-1.875)
Voltatic 0.3 Watt 6 Volt Solar panel
  rect 5x5 smd: 1(7.112,8.128) 2(-3.048,8.001)

## Nets
As in the schematic.

Pads without a net: C22 1 2; C23 1 2; C24 1 2; C25 1 2; C26 1 2; C27 1 2; C28 1 2; C29 1 2; C30 1 2; C31 1 2; C32 1 2; C33 1 2; LDO1 4; R7 1 2; R8 1 2; R9 1 2; R10 1 2; R11 1 2; R12 1 2; R13 1 2; R14 1 2; R15 1 2; R16 1 2; R17 1 2; R18 1 2; R19 1 2; R20 1 2; R21 1 2; R22 1 2; R23 1 2; R24 1 2; U1 3 4 5 6; U2 1; U3 6 7 8 9 10 11 12 19 21 22 33 36 38 39 40 41 42 43 44 45 47 48 51 52

## Via types
v1: diameter 0.61, hole 0.305, Top Layer to Bottom Layer, 62 vias

## Routing (per net, layer and track width the routed paths; a pad name or vN(x,y) marks a point on that pad's centre or on a via; arc(x,y) is an arc through that point)
3.3V: length 163.7
  Top Layer w0.14: 58.99,16.3 58.73,16.05 58.48,16.05 57.46,15.03 C10.2 C11.1 49.41,15.03 v1(48.63,14.25) 47.11,15.77 U3.29 ; 58.99,16.3 65.84,9.44 66.86,9.44 67.8,8.5 68.34,8.5 68.6,8.25 72.72,8.25 73.48,9.01 73.48,10.28 74.5,11.3 75.51,11.3 v1(76.78,12.57) ; 58.99,16.3 59.49,16.81 59.49,18.84 57.88,20.45 U4.8 57.46,20.71 55.39,22.78 C13.1 C12.2 52.03,23.41 v1(52.03,26.32) ; 44.77,24.83 44.77,25.98 C7.2 ; 44.77,24.83 44.77,24.58 C6.1 45.08,22.56 U3.46 ; 44.77,24.83 42.77,24.83 42.52,24.58 ; 42.52,24.58 42.52,24.97 C9.1 41.1,24.98 C16.1 ; 42.52,24.58 42.52,24.07 41.5,23.05 U3.55 U3.56 41.04,22.48 v1(40.18,22.48) ; 36.88,19.69 R1.1 ; 36.88,19.69 35.77,19.69 34.84,20.61 L1.1 C4.2 ; 36.88,19.69 37.39,20.2 37.64,20.2 38.15,20.71 v1(38.91,20.71) ; v1(43.1,16.41) U3.20
  Inner2 w0.14: 40.94,14.76 38.91,16.79 v1(38.91,20.71) ; 40.94,14.76 42.21,13.49 48.12,13.49 48.38,13.74 48.38,14 v1(48.63,14.25) ; 40.94,14.76 42.59,16.41 v1(43.1,16.41)
  Bottom Layer w0.14: v1(52.03,26.32) 52.63,26.93 59.57,26.93 R3.1 ; v1(40.18,22.48) 38.91,21.21 v1(38.91,20.71) ; v1(76.78,12.57) H2.6 78.57,20.45 78.57,39.76 79.07,40.25 C17.2 79.76,40.68 81.32,40.68 U1.8
GND: length 158.1
  Top Layer w0.14: v1(79.71,1.28) 77.52,3.46 BOOT.4 BOOT.3 ; 43.37,27.44 41.61,27.44 40.89,26.71 C16.2 ; 43.37,27.44 45.15,27.44 ; 43.37,27.44 42.5,26.57 C9.2 ; JP1.2 33.23,10.62 v1(33.23,9.28) ; U4.4 52.28,16.64 v1(54.31,18.67) ; C7.1 44.24,26.53 45.15,27.44 ; C6.2 44.22,24.25 v1(43.45,24.25) ; v1(57.61,11.94) 55.37,14.19 C10.1 C11.2 ; 67.52,14.1 U2.2 67.52,10.94 LDO1.2 ; 67.52,14.1 68.03,13.59 69.43,13.59 69.93,13.09 v1(69.93,12.2) ; 67.52,14.1 67.52,16.39 v1(66.51,17.4) ; 78.32,16.77 78.32,18.36 C18.2 ; v1(28.53,9.15) 28.53,10.24 JP1.3 ; 45.15,27.44 v1(47.84,27.44) ; v1(54.31,3.81) 50.25,7.88 BUZZER2.2 ; v1(57.61,6.36) 58.95,5.02 60.75,5.02 X1.2 64.28,3.12 v1(65.74,1.66) ; v1(35.9,20.45) 36.24,20.79 C1.2 ; v1(67.52,3.31) 65.96,3.31 C20.1 ; v1(50.63,24.64) 50.63,23.97 C12.1 C13.2 ; 57.87,2.38 59.23,1.02 v1(60.03,1.02) ; 33.99,19.31 33.99,20.16 C4.1 ; RST.4 RST.3 69.55,14.81 v1(69.55,15.75) ; v1(61.3,17.91) 61.3,16.72 R2.2 ; v1(83.9,11.94) 83.9,12.58 H2.5
  Bottom Layer w0.14: v1(84.41,4.96) 84.41,6.08 D.3 83.32,6.1 79.71,6.1 79.17,6.64 D.4 ; v1(78.32,11.69) 77.71,11.08 W.3 W.4 ; v1(35.01,18.42) 35.01,19.56 v1(35.9,20.45) ; v1(84.41,49.28) 84.41,48.27 83.93,47.78 U1.15 ; A.3 A.4 61.55,8.21 v1(61.55,8.64) ; 80.35,34.8 81.98,34.8 U1.2 ; 80.35,34.8 79.33,35.82 C17.1 81.63,39.41 U1.7 ; 80.35,34.8 81.37,33.78 U1.1 82,33.53 83.14,32.38 v1(83.14,30.23) ; v1(79.71,1.28) 79.17,1.81 S.3 S.4
  vias: v1(33.99,19.35) v1(78.32,16.8)
A: length 35.8
  Top Layer w0.14: U3.26 45.5,15.22 v1(46.01,14.71)
  Bottom Layer w0.14: 76.74,5.56 55.16,5.56 v1(46.01,14.71)
ANTMAN: length 14.6
  Top Layer w0.14: U5.2 31.15,16.38 31.15,20.72 32.93,22.5 37.5,22.5 38.26,21.74 U3.1
BAT+: length 12.5
  Top Layer w0.14: U2.3 68.53,12.51 68.53,10.81 ; LDO1.3 66.57,10.69 66.57,10.3 67.07,9.79 67.84,9.79 68.34,10.3 68.34,10.81 68.53,10.81 ; C21.2 72.22,11.25 H1.2 71.2,9.4 69.8,10.81 68.53,10.81
BUZZER: length 3.7
  Top Layer w0.14: BUZZER2.1 38.36,9.22 R6.1
CHIP_PU: length 60.2
  Top Layer w0.14: v1(69.89,17.37) RST.1 RST.2 76.74,15.42 81.11,11.05 82.13,11.05 82.89,10.29 82.89,5.97 H2.1 ; R1.2 38.56,19.56 39.53,20.54 U3.4 40.82,20.54 41.18,20.17 v1(41.18,18.64)
  Inner2 w0.14: v1(69.89,17.37) 67.73,19.53 46.14,19.53 45.5,18.9 45.5,18.14 44.74,17.37 42.45,17.37 v1(41.18,18.64)
CLK: length 12.4
  Top Layer w0.14: U4.6 57.42,17.96 56.25,17.96 52.95,21.26 49.39,21.26 47.87,19.74 U3.37
CS: length 64.8
  Top Layer w0.14: U3.15 40.85,15.98 v1(40.6,15.98) ; U3.32 48.47,17.74 49.23,18.5 51.77,18.5 52.03,18.75 52.03,19.89 v1(51.77,20.14) 50.71,20.14 U4.1
  Inner2 w0.14: v1(51.77,20.14) 51.01,20.9 42.63,20.9 40.34,18.62 40.34,16.23 v1(40.6,15.98)
  Bottom Layer w0.14: v1(51.77,20.14) 52.28,20.65 56.85,20.65 80.98,44.78 U1.12
D: length 41.2
  Top Layer w0.14: U3.28 v1(47.83,14.2)
  Bottom Layer w0.14: v1(47.83,14.2) 52.65,9.38 70.18,9.38 71.45,10.65 75.77,10.65 76.02,10.39 D.2 78.36,10.9 83.35,10.9 D.1
DC: length 56.3
  Top Layer w0.14: U3.14 40.04,16.28 40.04,15.65 41.61,14.08 42.88,14.08 v1(43.14,14.33)
  Inner2 w0.14: v1(50.25,14.33) 49.23,15.35 44.15,15.35 v1(43.14,14.33)
  Bottom Layer w0.14: U1.10 80.73,42.78 54.57,16.62 52.54,16.62 v1(50.25,14.33)
DI: length 12.8
  Top Layer w0.14: U4.5 57.45,16.65 v1(55.49,16.65) ; U3.35 v1(46.35,18.94)
  Inner2 w0.14: v1(46.35,18.94) 53.2,18.94 v1(55.49,16.65)
DO: length 3.6
  Top Layer w0.14: U3.34 47.87,18.54 48.52,19.18 U4.2
FMARK: length 71.1
  Top Layer w0.14: R5.1 46.49,13.47 v1(50.97,13.47)
  Bottom Layer w0.14: U1.14 82.08,46.7 83.27,46.7 83.78,46.19 83.78,17.82 82.21,16.26 81.45,16.26 77.13,11.94 76.37,11.94 74.85,13.47 v1(50.97,13.47)
GPIO0: length 50.8
  Top Layer w0.14: U3.5 40.26,20.17 39.76,20.17 39.5,19.91 39.5,15.6 42.3,12.8 55.76,12.8 61.35,7.21 BOOT.1 BOOT.2 81.59,7.21 H2.2
IO2: length 3.5
  Top Layer w0.14: U3.31 49.83,17.34 U4.3
IO3: length 15.4
  Top Layer w0.14: U4.7 57.66,18.99 58.03,18.99 59.05,17.97 59.05,17.72 58.54,17.21 55.24,17.21 53.95,15.92 49.39,15.92 48.38,16.94 U3.30
LMB: length 43.5
  Top Layer w0.14: U3.24 44.7,14.97 v1(44.45,14.71)
  Bottom Layer w0.14: v1(44.45,14.71) 37.08,7.34 LMB.1 LMB.2
RST: length 53.7
  Top Layer w0.14: v1(41.11,17.08) 40.96,16.94 U3.13
  Bottom Layer w0.14: v1(41.11,17.08) 41.36,17.33 46.69,17.33 50.5,21.14 56.34,21.14 80.98,45.78 U1.13
S: length 27.3
  Top Layer w0.14: U3.27 v1(45.9,16.49)
  Bottom Layer w0.14: v1(45.9,16.49) 47.42,14.97 48.95,14.97 49.46,14.46 49.46,13.95 53.4,10.01 A.2 A.1
SCL: length 53
  Top Layer w0.14: v1(41.87,14.82) 41.87,15.69 U3.17
  Inner2 w0.14: v1(47.96,16.09) 47.71,15.84 42.88,15.84 v1(41.87,14.82)
  Bottom Layer w0.14: v1(47.96,16.09) 48.98,17.11 54.31,17.11 80.98,43.78 U1.11
SDI: length 57.6
  Top Layer w0.14: U3.16 41.5,16.27 v1(41.76,16.52)
  Inner1 w0.14: v1(80.22,41.27) 79.59,41.91 59.77,41.91 40.74,22.87 40.74,22.25 40.41,21.93 40.41,19.09 40.63,18.87 40.63,18.41 41.63,17.41 41.63,17.34 41.66,17.31 41.66,16.85 41.63,16.81 41.63,16.65 v1(41.76,16.52)
  Bottom Layer w0.14: v1(80.22,41.27) 80.73,41.78 U1.9
U0RXD: length 44.5
  Top Layer w0.14: v1(44.46,23.5) 43.95,23.5 43.5,23.05 U3.50
  Inner1 w0.14: H2.3 67.9,23.5 v1(44.46,23.5)
U0TXD: length 42.8
  Top Layer w0.14: U3.49 43.9,22.1 44.28,21.72 v1(45.8,21.72)
  Inner2 w0.14: H2.4 78.57,12.32 68.41,22.48 46.57,22.48 v1(45.8,21.72)
V_CHARGE: length 60.3
  Top Layer w0.14: 79.02,19.05 78.17,19.9 74.04,19.9 73.28,20.66 ; U2.4 68.71,15.11 68.71,17.1 ; 68.71,17.1 72.27,20.66 73.28,20.66 ; 68.71,17.1 v1(60.07,25.74) ; H3.1 73.28,20.66
  Bottom Layer w0.14: U6.1 39.37,25.74 v1(60.07,25.74)
W: length 33.6
  Top Layer w0.14: U3.25 v1(45.1,16.49)
  Inner2 w0.14: v1(45.1,16.49) 45.86,17.25 47.89,17.25 50.18,14.97 v1(58.31,14.97)
  Bottom Layer w0.14: W.1 W.2 70.48,14.97 v1(58.31,14.97)
XTAL_N: length 31.2
  Top Layer w0.14: U3.53 42.3,23.05 42.55,23.31 42.81,23.31 v1(43.06,23.56) ; v1(54.49,12.13) 55.54,12.13 62.65,5.02 65.09,5.02 C20.2
  Inner1 w0.14: v1(43.06,23.56) v1(54.49,12.13)
XTAL_P: length 30.1
  Top Layer w0.14: U3.54 41.9,22.04 v1(41.39,21.53) ; X1.1 60.35,3.22 C19.2 48.96,12.13 v1(47.74,12.13)
  Inner1 w0.14: v1(47.74,12.13) 45.2,14.67 45.2,14.92 44.7,15.43 44.44,15.43 43.68,16.19 43.68,16.7 43.17,17.21 42.66,17.21 41.9,17.97 41.9,21.02 v1(41.39,21.53)
$1N2639: length 4.9
  Top Layer w0.14: L1.2 37.21,21.72 C1.1 37.59,21.34 U3.2 U3.3
$1N3558: length 2.6
  Top Layer w0.14: R2.1 64.03,14.87 U2.5
$1N4066: length 3.7
  Bottom Layer w0.14: R3.2 80.56,48.78 U1.16
$1N4566: length 4.2
  Top Layer w0.14: U3.18 42.32,15.71 42.32,15.25 42.58,14.99 43.34,14.99 44.61,13.72 R5.2
$1N5214: length 2.6
  Top Layer w0.14: JP1.1 U5.1
$1N5309: length 11.3
  Top Layer w0.14: v1(44.3,16.49) U3.23 ; R6.2 37.55,10.09 v1(40.85,13.39)
  Bottom Layer w0.14: v1(40.85,13.39) 41.36,13.39 44.3,16.33 v1(44.3,16.49)

## Copper pours and planes (outline as drawn; the poured copper is in the pictures)
GND on Top Layer: -4.23,58.68 92.03,58.68 92.03,-3.68 -4.23,-3.68
GND on Bottom Layer: -14.14,62.36 90.25,62.36 90.25,-4.06 -14.14,-4.06
GND on Inner1: -6.27,58.3 93.43,58.3 93.43,-2.03 -6.27,-2.03
GND on Inner2: -3.73,57.28 92.41,57.28 92.41,-5.33 -3.73,-5.33

## Text on the board
Top Silkscreen Layer: Try to do cool stuff ocassionally with electronics / research taking up the majority of my time | This is an ESP32 btw feel / free to do your own thing / and repurpose this | On a cool side note tho you can turn this around and have fun with / DOOM (1993) as this card cleared the sacred "Will It Run DOOM?" / rite in just enough time for this to actually be manifactured | The solar panel can run it for about "x" minutes and needs you to / flip it over for "y" minutes to charge the battery | The heart / running your / silky smooth 24FPS | My linkdin | Hobbyist | Aneesh Arnav Chikkala | Researcher | ·
